# Altium project bq78pl116 BMS.PrjPcb (part 1 of 2)
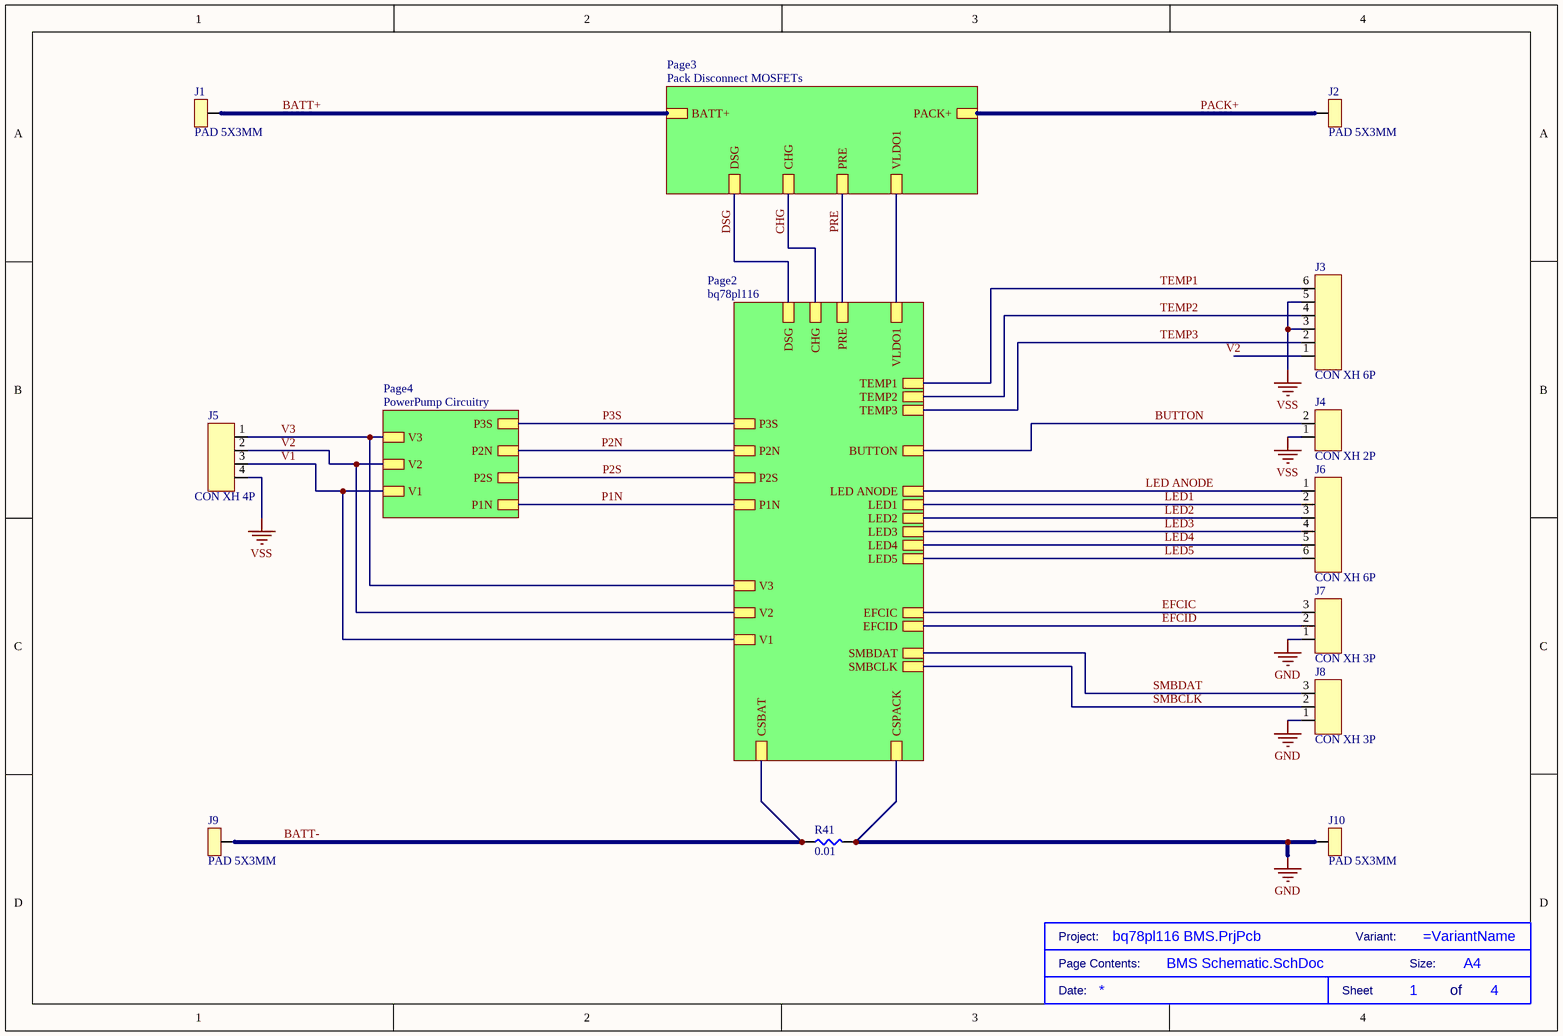
[diagram p0: BMS Schematic.SchDoc]
4 sheets, 108 parts. Net scope: hierarchical (ports join the sheet entries above them; power ports are global).
Board file: BMS PCB.PcbDoc
Sheets:
  BMS Schematic.SchDoc
    Page3 = Pack Disconnect MOSFETs.SchDoc
    Page4 = PowerPump Circuitry.SchDoc
    Page2 = bq78pl116.SchDoc

## Sheet BMS Schematic.SchDoc
size A4; DocumentNumber: 1; SheetNumber: 1; SheetTotal: 4

### Parts
(Parts that share a designator on the sheet are numbered #1, #2 ... from top to bottom, then left to right.)
*#1  Size: A4  (hidden comment: TITLE BLOCK)  (graphical)
J1  PAD 5X3MM  [PAD 5X3MM]
J2  PAD 5X3MM  [PAD 5X3MM]
J3  CON XH 6P  [XH 2.5 6P]
J4  CON XH 2P  [XH 2.5 2P]
J5  CON XH 4P  [XH 2.5 4P]
J6  CON XH 6P  [XH 2.5 6P]
J7  CON XH 3P  [XH 2.5 3P]
J8  CON XH 3P  [XH 2.5 3P]
J9  PAD 5X3MM  [PAD 5X3MM]
J10  PAD 5X3MM  [PAD 5X3MM]
R41  0.01  [RSHUNT]

### Sub-sheets
Page2 = bq78pl116: DSG, PRE, TEMP3, CHG, LED5, VLDO1, TEMP2, V2, LED3, BUTTON, LED4, LED1, LED2, SMBCLK, P1N, CSBAT, P2S, P2N, P3S, V1, V3, EFCID, EFCIC, LED ANODE, CSPACK, SMBDAT, TEMP1
Page3 = Pack Disconnect MOSFETs: VLDO1, DSG, CHG, BATT+, PRE, PACK+
Page4 = PowerPump Circuitry: P2N, P3S, P2S, P1N, V2, V3, V1

### Nets
GND: J7.1 J8.1 J10.1 R41.2 ; sheet Page2/CSPACK
VLDO1: sheet Page3/VLDO1, sheet Page2/VLDO1
VSS: J3.3 J3.5 J4.1 J5.4
BATT+: J1.1 ; sheet Page3/BATT+
BATT-: J9.1 R41.1 ; sheet Page2/CSBAT
BUTTON: J4.2 ; sheet Page2/BUTTON
CHG: sheet Page3/CHG, sheet Page2/CHG
DSG: sheet Page3/DSG, sheet Page2/DSG
EFCIC: J7.3 ; sheet Page2/EFCIC
EFCID: J7.2 ; sheet Page2/EFCID
LED1: J6.2 ; sheet Page2/LED1
LED2: J6.3 ; sheet Page2/LED2
LED3: J6.4 ; sheet Page2/LED3
LED4: J6.5 ; sheet Page2/LED4
LED5: J6.6 ; sheet Page2/LED5
LED ANODE: J6.1 ; sheet Page2/LED ANODE
P1N: sheet Page4/P1N, sheet Page2/P1N
P2N: sheet Page4/P2N, sheet Page2/P2N
P2S: sheet Page4/P2S, sheet Page2/P2S
P3S: sheet Page4/P3S, sheet Page2/P3S
PACK+: J2.1 ; sheet Page3/PACK+
PRE: sheet Page3/PRE, sheet Page2/PRE
SMBCLK: J8.2 ; sheet Page2/SMBCLK
SMBDAT: J8.3 ; sheet Page2/SMBDAT
TEMP1: J3.6 ; sheet Page2/TEMP1
TEMP2: J3.4 ; sheet Page2/TEMP2
TEMP3: J3.2 ; sheet Page2/TEMP3
V1: J5.3 ; sheet Page4/V1, sheet Page2/V1
V2: J3.1 J5.2 ; sheet Page4/V2, sheet Page2/V2
V3: J5.1 ; sheet Page4/V3, sheet Page2/V3

### Notes on the sheet
- (in symbol TITLE BLOCK) Project:; Variant:; Page Contents:; Size:; Date:; Sheet; of

### Library data of the parts
J3 J6 = CONN XH 2.5 6P: CONN HEADER VERT 6POS 2.5MM; Manufacturer: JST; Manufacturer Part Number: B6BXHA(LF)(SN); Supplier 1: Distrelec; RoHS: Yes; Category: FFC / FPC; ComponentLink1URL: https://datasheet.ciiva.com/26894/getdatasheetpartid-424647-26894806.pdf?src-supplier=Verical; ComponentLink1Description: https://datasheet.ciiva.com/26894/getdatasheetpartid-424647-26894806.pdf?src-supplier=Verical; ComponentLink2URL: https://datasheet.ciiva.com/26894/getdatasheetpartid-641012-26894489.pdf?src-supplier=Verical; ComponentLink2Description: https://datasheet.ciiva.com/26894/getdatasheetpartid-641012-26894489.pdf?src-supplier=Verical; ComponentLink3URL: https://datasheet.ciiva.com/712/exh-712511.pdf?src-supplier=Digi-Key; ComponentLink3Description: https://datasheet.ciiva.com/712/exh-712511.pdf?src-supplier=Digi-Key; ComponentLink4URL: https://datasheet.ciiva.com/16397/b6b-xh-alfsn-16397116.pdf?src-supplier=Future+Electronics; ComponentLink4Description: https://datasheet.ciiva.com/16397/b6b-xh-alfsn-16397116.pdf?src-supplier=Future+Electronics; Supplier Part Number 1: 14301998
J4 = CONN XH 2.5 2P: 2 Position Dual Row 2.5 mm Pitch Through Hole Shrouded Header; Manufacturer: JST; Manufacturer Part Number: B2B-XH-A-GU; Supplier 1: Digi-Key; RoHS: Yes; Category: Headers and Wire Housings; Stock 1: 22513; Pricing 1: 1=0,24000, 10=0,20400, 100=0,15680, 500=0,13270, 1000=0,10858, 5000=0,09652, 10000=0,08747 (USD); ComponentLink1URL: https://datasheet.ciiva.com/16417/exh-16417678.pdf?src-supplier=Future+Electronics; ComponentLink1Description: https://datasheet.ciiva.com/16417/exh-16417678.pdf?src-supplier=Future+Electronics; Supplier Part Number 1: 455-2946-ND
J5 = CONN XH 2.5 4P: XH Series 4 Position 2.5 mm Pitch Through Hole Crimp Top Entry Shrouded Header; Manufacturer: JST; Manufacturer Part Number: B4B-XH-A(LF)(SN); Supplier 1: RSComponents; RoHS: Yes; Category: FFC / FPC; Stock 1: 10520; Pricing 1: 5=0,42800, 125=0,15600, 500=0,14600, 1250=0,13600, 2500=0,12800 (GBP); ComponentLink1URL: https://datasheet.ciiva.com/16203/b4b-xh-alfsn-16203642.pdf?src-supplier=Future+Electronics; ComponentLink1Description: https://datasheet.ciiva.com/16203/b4b-xh-alfsn-16203642.pdf?src-supplier=Future+Electronics; ComponentLink2URL: https://datasheet.ciiva.com/26924/getdatasheetpartid-640571-26924035.pdf?src-supplier=Verical; ComponentLink2Description: https://datasheet.ciiva.com/26924/getdatasheetpartid-640571-26924035.pdf?src-supplier=Verical; ComponentLink3URL: https://datasheet.ciiva.com/26894/getdatasheetpartid-455616-26894787.pdf?src-supplier=Verical; ComponentLink3Description: https://datasheet.ciiva.com/26894/getdatasheetpartid-455616-26894787.pdf?src-supplier=Verical; ComponentLink4URL: https://datasheet.ciiva.com/726/exh-726404.pdf?src-supplier=Digi-Key; ComponentLink4Description: https://datasheet.ciiva.com/726/exh-726404.pdf?src-supplier=Digi-Key; Supplier Part Number 1: 8201551
J7 J8 = CONN XH 2.5 3P: Connector Header, XH Series, 3 Position, 2.50mm, Through Hole, Press-Fit, Solder, Natural; Manufacturer: JST; Manufacturer Part Number: B3B-XH-A(LF)(SN); Supplier 1: RSComponents; RoHS: Yes; Category: Headers and Wire Housings; Stock 1: 43000; Pricing 1: 1000=0,07100 (GBP); ComponentLink1URL: https://datasheet.ciiva.com/26894/getdatasheetpartid-640434-26894454.pdf?src-supplier=Verical; ComponentLink1Description: https://datasheet.ciiva.com/26894/getdatasheetpartid-640434-26894454.pdf?src-supplier=Verical; ComponentLink2URL: https://datasheet.ciiva.com/26894/getdatasheetpartid-440399-26894778.pdf?src-supplier=Verical; ComponentLink2Description: https://datasheet.ciiva.com/26894/getdatasheetpartid-440399-26894778.pdf?src-supplier=Verical; ComponentLink3URL: https://datasheet.ciiva.com/11746/0900766b8082653f-11746520.pdf?src-supplier=RSComponents; ComponentLink3Description: https://datasheet.ciiva.com/11746/0900766b8082653f-11746520.pdf?src-supplier=RSComponents; Supplier Part Number 1: 1724888
R41 = SHUNT 10m

## Sheet Pack Disconnect MOSFETs.SchDoc
size A4; DocumentNumber: 3; SheetNumber: 3; SheetTotal: 4
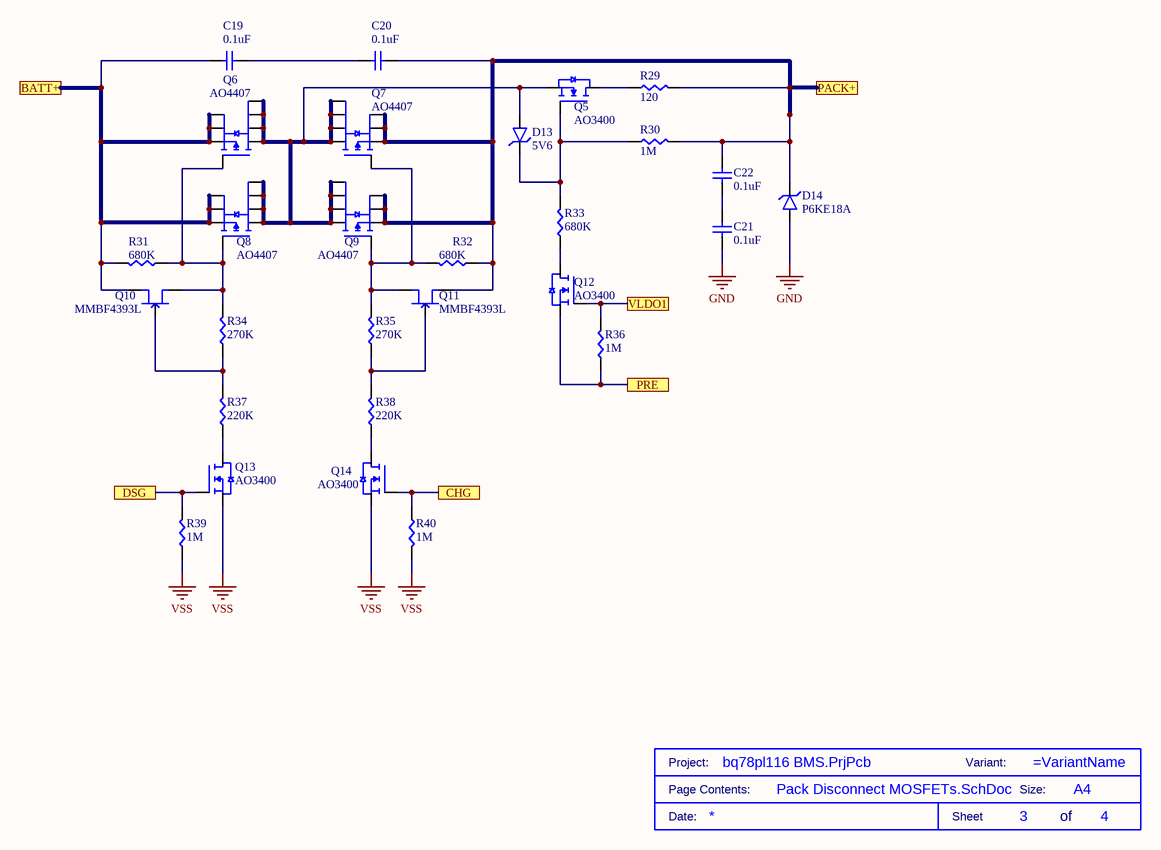
[diagram p1: Pack Disconnect MOSFETs.SchDoc]

### Parts
(Parts that share a designator on the sheet are numbered #1, #2 ... from top to bottom, then left to right.)
*#2  Size: A4  (hidden comment: TITLE BLOCK)  (graphical)
C19  0.1uF  [C0805]
C20  0.1uF  [C0805]
C21  0.1uF  [C0805]
C22  0.1uF  [C0805]
D13  5V6  [MiniMELF]
D14  P6KE18A  [DO-15]
Q5  AO3400  [SOT-23]
Q6  AO4407  [SOIC-8]
Q7  AO4407  [SOIC-8]
Q8  AO4407  [SOIC-8]
Q9  AO4407  [SOIC-8]
Q10  MMBF4393L  [SOT-23]
Q11  MMBF4393L  [SOT-23]
Q12  AO3400  [SOT-23]
Q13  AO3400  [SOT-23]
Q14  AO3400  [SOT-23]
R29  120  [RES TH 1W]
R30  1M  [R0805]
R31  680K  [R0805]
R32  680K  [R0805]
R33  680K  [R0805]
R34  270K  [R0805]
R35  270K  [R0805]
R36  1M  [R0805]
R37  220K  [R0805]
R38  220K  [R0805]
R39  1M  [R0805]
R40  1M  [R0805]

### Ports
BATT+, CHG, DSG, PACK+, PRE, VLDO1

### Nets
GND: C21.2 D14.1(A)
VLDO1: Q12.1(G) R36.2 ; port VLDO1
VSS: Q13.2(S) Q14.2(S) R39.1 R40.1
BATT+: C19.1 Q6.1(S) Q6.2(S) Q6.3(S) Q8.1(S) Q8.2(S) Q8.3(S) Q10.1(D) R31.2 ; port BATT+
CHG: Q14.1(G) R40.2 ; port CHG
DSG: Q13.1(G) R39.2 ; port DSG
PACK+: C20.2 C22.1 D14.2(K) Q7.1(S) Q7.2(S) Q7.3(S) Q9.1(S) Q9.2(S) Q9.3(S) Q11.1(D) R29.2 R30.2 R32.1 ; port PACK+
PRE: Q12.2(S) R36.1 ; port PRE
NetC19_2: C19.2 C20.1
NetC21_1: C21.1 C22.2
NetD13_1: D13.1(A) Q5.2(S) Q6.5(D) Q6.6(D) Q6.7(D) Q6.8(D) Q7.5(D) Q7.6(D) Q7.7(D) Q7.8(D) Q8.5(D) Q8.6(D) Q8.7(D) Q8.8(D) Q9.5(D) Q9.6(D) Q9.7(D) Q9.8(D)
NetD13_2: D13.2(K) Q5.1(G) R30.1 R33.2
NetQ5_3: Q5.3(D) R29.1
NetQ6_4: Q6.4(G) Q8.4(G) Q10.2(S) R31.1 R34.2
NetQ7_4: Q7.4(G) Q9.4(G) Q11.2(S) R32.2 R35.2
NetQ10_3: Q10.3(G) R34.1 R37.2
NetQ11_3: Q11.3(G) R35.1 R38.2
NetQ12_3: Q12.3(D) R33.1
NetQ13_3: Q13.3(D) R37.1
NetQ14_3: Q14.3(D) R38.1

### Notes on the sheet
- (in symbol TITLE BLOCK) Project:; Variant:; Page Contents:; Size:; Date:; Sheet; of

### Library data of the parts
C19-C22 = CAP 0805 0.1uF: Cap Ceramic 0.1uF 50V X7R 10% SMD 0805 125°C Paper T/R; Manufacturer: KEMET; Manufacturer Part Number: C0805C104K5RAC7411; Capacitance: 100nF; Supplier 1: Mouser; RoHS: Yes; Category: Ceramic Capacitors; Stock 1: 1204859; Pricing 1: 1=0,13000, 10=0,09300, 50=0,09300, 100=0,04400, 1000=0,02600, 10000=0,02100 (USD); Mount: Surface Mount; Case/Package: 0805; Dielectric Material: Ceramic; Min Operating Temperature: -55°C; Max Operating Temperature: 125°C; Packaging: Tape and Reel; Tolerance: 10%; Dielectric: X7R; Voltage Rating (DC): 50V; Construction: Flat; Length: 2mm; Height: 0.9mm; Depth: 1.25mm; Radiation Hardening: No; RoHS Compliant: Yes; ComponentLink1URL: http://components.arrow.com/part/dataview/30748302S8994022N7429?src-supplier=Arrow+Electronics; ComponentLink1Description: http://components.arrow.com/part/dataview/30748302S8994022N7429?src-supplier=Arrow+Electronics; ComponentLink2URL: https://www.verical.com/server-webapp/html/getDatasheet?partID=248513&src-supplier=Verical; ComponentLink2Description: https://www.verical.com/server-webapp/html/getDatasheet?partID=248513&src-supplier=Verical; Supplier Part Number 1: 80-C0805C104K5RACLR
D13 = ZENER 5V6: Diode Zener Single 5.6V 7% 500mW Automotive 2-Pin Mini-MELF T/R; Manufacturer: Diotec; Manufacturer Part Number: ZMM5.6; Tolerance: 5%; Supplier 1: Arrow Electronics; RoHS: Yes; Category: Zener Diodes; Stock 1: 11; Pricing 1: 1=0,10930, 10=0,02530 (USD); Case/Package: SOD; Zener Voltage: 5.6V; Power Dissipation: 500mW; RoHS Compliant: Yes; ComponentLink1URL: https://datasheet.ciiva.com/26309/rvzmm1-zmm75-data-e-26309545.pdf?src-supplier=Distrelec; ComponentLink1Description: https://datasheet.ciiva.com/26309/rvzmm1-zmm75-data-e-26309545.pdf?src-supplier=Distrelec; Supplier Part Number 1: ZMM5.6
D14 = P6KE18A: TVS DIODE 15.3VWM 32.5VC DO15; Manufacturer: Littelfuse; Clamping Voltage: 25.2V; Peak Pulse Power: 600W; Number of Unidirectional Channels: 1; Reverse Standoff Voltage: 15.3V; Min Breakdown Voltage: 17.1V; Power Line Protection: No; Peak Pulse Current: 24.2A; Max Surge Current: 24A; Polarity: Unidirectional; Test Current: 1mA; Leakage Current: 1uA; Voltage Rating (DC): 18V; Diode Type: ZENER; Max Breakdown Voltage: 18.9V; Max Power Dissipation: 5W; Supplier 1: Arrow Electronics; Manufacturer Part Number: P6KE18A; RoHS: Yes; Category: Diodes; Stock 1: 2982; Pricing 1: 1=0,51800, 10=0,42000, 25=0,41460, 100=0,29520, 250=0,29500, 500=0,23600, 1000=0,17410 (USD); Mount: Through Hole; Case/Package: DO-15; Number of Pins: 2; Min Operating Temperature: -55°C; Max Operating Temperature: 175°C; Packaging: Tape and Reel; Resistor Type: Zener; Package Quantity: 4000; Operating Supply Voltage: 15.3V; Reverse Breakdown Voltage: 17.1V; Breakdown Voltage: 17.1V; Number of Channels: 1; Termination: Axial; Number of Elements: 1; Series: P6KE; Direction: Unidirectional; Max Reverse Leakage Current: 1uA; Power Dissipation: 600W; Clamping Voltage-Max: 25.2V; Diameter: 3.6mm; Length: 7.6mm; Lead Free: Lead Free; RoHS Compliant: Yes; REACH SVHC: No SVHC; ComponentLink1URL: https://datasheet.ciiva.com/16473/littelfuse-tvs-diode-p6ke-16473576.pdf?src-supplier=Future+Electronics; ComponentLink1Description: https://datasheet.ciiva.com/16473/littelfuse-tvs-diode-p6ke-16473576.pdf?src-supplier=Future+Electronics; ComponentLink2URL: https://datasheet.ciiva.com/331/littelfuse-tvs-diode-p6ke-datasheet-pdf-331022.pdf?src-supplier=Digi-Key; ComponentLink2Description: https://datasheet.ciiva.com/331/littelfuse-tvs-diode-p6ke-datasheet-pdf-331022.pdf?src-supplier=Digi-Key; ComponentLink3URL: https://datasheet.ciiva.com/331/littelfuse-tvs-diode-p6ke-datasheet-pdf-331021.pdf?src-supplier=Digi-Key; ComponentLink3Description: https://datasheet.ciiva.com/331/littelfuse-tvs-diode-p6ke-datasheet-pdf-331021.pdf?src-supplier=Digi-Key; Supplier Part Number 1: P6KE18A
Q5 Q12-Q14 = AO3400: Trans MOSFET N-CH 30V 5.7A 3-Pin SOT-23; Manufacturer: Alpha & Omega Semiconductor; Manufacturer Part Number: AO3400A; Rds On Max: 26.5mR; Input Capacitance: 630pF; Max Power Dissipation: 1.4W; Number of Elements: 1; Gate to Source Voltage (Vgs): 12V; Supplier 1: TME; RoHS: Yes; Category: MOSFETs; Pricing 1: 10=0,07570, 50=0,06820, 250=0,06030, 1000=0,05410, 3000=0,05050 (EUR); Mount: Surface Mount; Case/Package: TO-236-3; Number of Pins: 3; Min Operating Temperature: -55°C; Max Operating Temperature: 150°C; Packaging: Tape and Reel; Series: -; Drain to Source Voltage (Vdss): 30V; Continuous Drain Current (ID): 5.7A; Power Dissipation: 1.4W; Radiation Hardening: No; RoHS Compliant: Yes; Lead Free: Lead Free; ComponentLink1URL: https://datasheet.ciiva.com/940/ao3400a-940739.pdf?src-supplier=Digi-Key; ComponentLink1Description: https://datasheet.ciiva.com/940/ao3400a-940739.pdf?src-supplier=Digi-Key; ComponentLink2URL: https://datasheet.ciiva.com/26906/getdatasheetpartid-64438-26906526.pdf?src-supplier=Verical; ComponentLink2Description: https://datasheet.ciiva.com/26906/getdatasheetpartid-64438-26906526.pdf?src-supplier=Verical; ComponentLink3URL: https://datasheet.ciiva.com/940/ao3400a-940740.pdf?src-supplier=Digi-Key; ComponentLink3Description: https://datasheet.ciiva.com/940/ao3400a-940740.pdf?src-supplier=Digi-Key; ComponentLink4URL: https://datasheet.ciiva.com/940/ao3400a-940741.pdf?src-supplier=Digi-Key; ComponentLink4Description: https://datasheet.ciiva.com/940/ao3400a-940741.pdf?src-supplier=Digi-Key; Supplier Part Number 1: AO3400A
Q6-Q9 = AO4407: MOSFET P-CH 30V 12A 8SOIC; Manufacturer: Alpha & Omega Semiconductor; Manufacturer Part Number: AO4407A; Rds On Max: 11mR; Input Capacitance: 2.6nF; Max Power Dissipation: 3.1W; Number of Elements: 1; Gate to Source Voltage (Vgs): 25V; ComponentLink1URL: https://media.digikey.com/pdf/Data%20Sheets/Alpha%20&amp;%20Omega/AO4407_Doc..pdf?src-supplier=Digi-Key; ComponentLink1Description: https://media.digikey.com/pdf/Data%20Sheets/Alpha%20&amp;%20Omega/AO4407_Doc..pdf?src-supplier=Digi-Key; Supplier 1: Arrow Electronics; RoHS: Yes; Category: MOSFETs; Stock 1: 3000; Pricing 1: 3000=0,93470, 6000=0,85170, 9000=0,75520, 15000=0,71280, 24000=0,62350, 30000=0,61730 (USD); Mount: Surface Mount; Case/Package: SOIC; Number of Pins: 8; Min Operating Temperature: -55°C; Max Operating Temperature: 150°C; Packaging: Tape and Reel; Drain to Source Voltage (Vdss): 30V; Continuous Drain Current (ID): 12A; Power Dissipation: 3.1W; Series: -; Radiation Hardening: No; Lead Free: Lead Free; RoHS Compliant: Yes; ComponentLink2URL: https://datasheet.ciiva.com/940/ao4407a-940836.pdf?src-supplier=Digi-Key; ComponentLink2Description: https://datasheet.ciiva.com/940/ao4407a-940836.pdf?src-supplier=Digi-Key; ComponentLink3URL: https://datasheet.ciiva.com/940/ao4407a-940838.pdf?src-supplier=Digi-Key; ComponentLink3Description: https://datasheet.ciiva.com/940/ao4407a-940838.pdf?src-supplier=Digi-Key; Supplier Part Number 1: AO4407A
Q10 Q11 = MMBF4393L: Trans Jfet N-ch 30V 3-PIN SOT-23 T/r; Manufacturer: ON Semiconductor; Manufacturer Part Number: MMBF4393LT3G; Input Capacitance: 14pF; Max Power Dissipation: 225mW; Element Configuration: Single; Polarity: N-CHANNEL; Supplier 1: Digi-Key; RoHS: Yes; Category: JFETs; Stock 1: 422; Pricing 1: 1=0,41000, 10=0,33600, 100=0,22840, 500=0,17134, 1000=0,12850, 2000=0,11780, 5000=0,11065 (USD); Mount: Surface Mount; Case/Package: SOT-23; Number of Pins: 3; Weight: 0.00709oz; Min Operating Temperature: -55°C; Max Operating Temperature: 150°C; Packaging: Tape and Reel; Package Quantity: 10000; Drain to Source Voltage (Vdss): 30V; Gate to Source Voltage (Vgs): 30V; Power Dissipation: 225mW; Breakdown Voltage: 30V; Series: -; Reach SVHC Compliant: Yes; Lead Free: Lead Free; Halogen Free: Halogen Free; RoHS Compliant: Yes; ComponentLink1URL: https://datasheet.ciiva.com/961/mmbf4391lt1-d-961042.pdf?src-supplier=Avnet; ComponentLink1Description: https://datasheet.ciiva.com/961/mmbf4391lt1-d-961042.pdf?src-supplier=Avnet; ComponentLink2URL: https://datasheet.ciiva.com/961/mmbf4391lt1-d-961129.pdf?src-supplier=Digi-Key; ComponentLink2Description: https://datasheet.ciiva.com/961/mmbf4391lt1-d-961129.pdf?src-supplier=Digi-Key; Supplier Part Number 1: MMBF4393LT3GOSCT-ND
R29 = RES TH 120 1W: Ultra Miniature Style Metal Film Resistor 120Ohm 1W 5% Axial T/R; Manufacturer: Yageo; Manufacturer Part Number: FMP100JR-52-120R; Resistance: 120R; Supplier 1: Arrow Electronics; RoHS: Yes; Category: Through-Hole Resistors; Stock 1: 18475; Pricing 1: 1=0,18070, 10=0,15020, 25=0,10430, 100=0,06410, 250=0,04920, 500=0,03870, 1000=0,02670, 3000=0,02540, 6000=0,02180, 15000=0,02010 (USD); Case/Package: Axial; Min Operating Temperature: -55°C; Max Operating Temperature: 155°C; Package Quantity: 1; Tolerance: 5%; Packaging: Tape and Reel; Number of Terminations: 2; Max Power Dissipation: 1W; Series: FMP; Resistor Type: Metal Film; Length: 0.248inch; Lead Free: Lead Free; RoHS Compliant: Yes; ComponentLink1URL: https://datasheet.ciiva.com/2710/yageolr-fmp-2013-2710614.pdf?src-supplier=Digi-Key; ComponentLink1Description: https://datasheet.ciiva.com/2710/yageolr-fmp-2013-2710614.pdf?src-supplier=Digi-Key; ComponentLink2URL: https://datasheet.ciiva.com/2710/yageolr-fmp-2013-2710613.pdf?src-supplier=Digi-Key; ComponentLink2Description: https://datasheet.ciiva.com/2710/yageolr-fmp-2013-2710613.pdf?src-supplier=Digi-Key; Supplier Part Number 1: FMP100JR-52-120R
R30 R36 R39 R40 = RES 0805 1M: Res Thick Film 0805 1M Ohm 5% 0.125W(1/8W) ±200ppm/°C Pad SMD T/R; Manufacturer: Vishay; Manufacturer Part Number: CRCW08051M00JNEAC; Supplier 1: Mouser; RoHS: No; Category: Chip SMD Resistors; Stock 1: 183; Pricing 1: 1=0,10000, 10=0,04000, 50=0,04000, 100=0,01700, 250=0,01600, 500=0,01500, 1000=0,00800, 2500=0,00700, 5000=0,00500, 10000=0,00500 (USD); Supplier Part Number 1: 71-CRCW08051M00JNEAC
R31-R33 = RES 0805 680K: Res Thick Film 0805 680K Ohm 5% 1/8W ±200ppm/°C Molded SMD SMD Paper T/R; Manufacturer: Vishay Dale; Manufacturer Part Number: CRCW0805680KJNEA; Resistance: 680kR; Power Rating: 125mW; Voltage Rating: 150V; Supplier 1: Digi-Key; RoHS: Yes; Category: Chip SMD Resistors; Stock 1: 65; Pricing 1: 1=0,10000, 10=0,04800, 100=0,01950, 1000=0,00874, 2500=0,00759 (USD); Case/Package: 0805; Number of Pins: 2; Weight: 0.000194oz; Case Code (Metric): 2012; Case Code (Imperial): 0805; Contact Plating: Tin; Size Code: 0805; Min Operating Temperature: -55°C; Max Operating Temperature: 155°C; Package Quantity: 1; Tolerance: 5%; Packaging: Tape and Reel; Resistor Type: Thick Film; Number of Terminations: 2; Temperature Coefficient: 200ppm/°C; Max Power Dissipation: 125mW; Voltage Rating (DC): 150V; Features: Automotive AEC-Q200; Series: CRCW; Resistance Tolerance: 5%; Construction: Rectangular; Length: 2mm; Width: 0.049inch; Height: 0.02inch; Depth: 1.25mm; Radiation Hardening: No; REACH SVHC: Unknown; Military Standard: Not; Lead Free: Lead Free; RoHS Compliant: Yes; ComponentLink1URL: https://datasheet.ciiva.com/2493/dcrcwe3-2493920.pdf?src-supplier=Digi-Key; ComponentLink1Description: https://datasheet.ciiva.com/2493/dcrcwe3-2493920.pdf?src-supplier=Digi-Key; ComponentLink2URL: https://datasheet.ciiva.com/2493/dcrcwe3-2493921.pdf?src-supplier=Digi-Key; ComponentLink2Description: https://datasheet.ciiva.com/2493/dcrcwe3-2493921.pdf?src-supplier=Digi-Key; ComponentLink3URL: https://datasheet.ciiva.com/5546/dcrcwe3-109170-5546277.pdf?src-supplier=Mouser; ComponentLink3Description: https://datasheet.ciiva.com/5546/dcrcwe3-109170-5546277.pdf?src-supplier=Mouser; ComponentLink4URL: https://datasheet.ciiva.com/8924/dcrcwe3-8924022.pdf?src-supplier=Avnet; ComponentLink4Description: https://datasheet.ciiva.com/8924/dcrcwe3-8924022.pdf?src-supplier=Avnet; ComponentLink5URL: https://datasheet.ciiva.com/2493/dcrcwe3-2493919.pdf?src-supplier=Digi-Key; ComponentLink5Description: https://datasheet.ciiva.com/2493/dcrcwe3-2493919.pdf?src-supplier=Digi-Key; Supplier Part Number 1: 541-680KACT-ND
R34 R35 = RES 0805 270K: Res Thick Film 0805 270K Ohm 5% 1/8W ±200ppm/°C Molded SMD SMD Paper T/R; Manufacturer: Vishay Dale; Manufacturer Part Number: CRCW0805270KJNEA; Resistance: 270kR; Power Rating: 125mW; Voltage Rating: 150V; Supplier 1: Arrow Electronics; RoHS: Yes; Category: Chip SMD Resistors; Stock 1: 4; Pricing 1: 1=0,04400 (USD); Case/Package: 0805; Number of Pins: 2; Weight: 0.000194oz; Case Code (Metric): 2012; Case Code (Imperial): 0805; Contact Plating: Tin; Size Code: 0805; Min Operating Temperature: -55°C; Max Operating Temperature: 155°C; Tolerance: 5%; Packaging: Tape and Reel; Package Quantity: 1; Resistor Type: Thick Film; Number of Terminations: 2; Termination: SMD/SMT; Temperature Coefficient: 200ppm/°C; Max Power Dissipation: 125mW; Voltage Rating (DC): 150V; Features: Automotive AEC-Q200; Series: CRCW; Construction: Rectangular; Resistance Tolerance: 5%; Length: 2mm; Width: 0.049inch; Height: 0.02inch; Depth: 1.25mm; Radiation Hardening: No; REACH SVHC: Unknown; Military Standard: Not; Lead Free: Lead Free; RoHS Compliant: Yes; ComponentLink1URL: https://datasheet.ciiva.com/2493/dcrcwe3-2493829.pdf?src-supplier=Digi-Key; ComponentLink1Description: https://datasheet.ciiva.com/2493/dcrcwe3-2493829.pdf?src-supplier=Digi-Key; ComponentLink2URL: https://datasheet.ciiva.com/2493/dcrcwe3-2493830.pdf?src-supplier=Digi-Key; ComponentLink2Description: https://datasheet.ciiva.com/2493/dcrcwe3-2493830.pdf?src-supplier=Digi-Key; ComponentLink3URL: https://datasheet.ciiva.com/2493/dcrcwe3-2493831.pdf?src-supplier=Digi-Key; ComponentLink3Description: https://datasheet.ciiva.com/2493/dcrcwe3-2493831.pdf?src-supplier=Digi-Key; ComponentLink4URL: https://datasheet.ciiva.com/3258/dcrcwe3-3258391.pdf?src-supplier=Avnet; ComponentLink4Description: https://datasheet.ciiva.com/3258/dcrcwe3-3258391.pdf?src-supplier=Avnet; ComponentLink5URL: https://datasheet.ciiva.com/5549/dcrcwe3-109170-5549770.pdf?src-supplier=Mouser; ComponentLink5Description: https://datasheet.ciiva.com/5549/dcrcwe3-109170-5549770.pdf?src-supplier=Mouser; ComponentLink6URL: https://datasheet.ciiva.com/16500/dcrcwe3-16500506.pdf?src-supplier=Future+Electronics; ComponentLink6Description: https://datasheet.ciiva.com/16500/dcrcwe3-16500506.pdf?src-supplier=Future+Electronics; Supplier Part Number 1: CRCW0805270KJNEA
R37 R38 = RES 0805 220K: Res Thick Film 0805 220K Ohm 5% 1/8W ±200ppm/°C Molded SMD SMD Paper T/R; Manufacturer: Vishay Dale; Manufacturer Part Number: CRCW0805220KJNEA; Resistance: 220kR; Power Rating: 125mW; Voltage Rating: 150V; Supplier 1: Arrow Electronics; RoHS: Yes; Category: Chip SMD Resistors; Stock 1: 277; Pricing 1: 1=0,05510, 10=0,03660, 25=0,03490, 50=0,03450, 100=0,02070, 250=0,01310 (USD); Mount: Surface Mount; Case/Package: 0805; Weight: 0.000194oz; Case Code (Metric): 2012; Case Code (Imperial): 0805; Contact Plating: Tin; Size Code: 0805; Min Operating Temperature: -55°C; Max Operating Temperature: 155°C; Package Quantity: 1; Tolerance: 5%; Packaging: Tape and Reel; Resistor Type: Thick Film; Number of Terminations: 2; Termination: SMD/SMT; Temperature Coefficient: 200ppm/°C; Max Power Dissipation: 125mW; Voltage Rating (DC): 150V; Features: Automotive AEC-Q200; Series: CRCW; Construction: Rectangular; Resistance Tolerance: 5%; Length: 2mm; Width: 0.049inch; Height: 0.02inch; Depth: 1.25mm; Radiation Hardening: No; REACH SVHC: Unknown; Military Standard: Not; Lead Free: Lead Free; RoHS Compliant: Yes; ComponentLink1URL: https://datasheet.ciiva.com/2464/dcrcwe3-2464864.pdf?src-supplier=Digi-Key; ComponentLink1Description: https://datasheet.ciiva.com/2464/dcrcwe3-2464864.pdf?src-supplier=Digi-Key; ComponentLink2URL: https://datasheet.ciiva.com/2464/dcrcwe3-2464865.pdf?src-supplier=Digi-Key; ComponentLink2Description: https://datasheet.ciiva.com/2464/dcrcwe3-2464865.pdf?src-supplier=Digi-Key; ComponentLink3URL: https://datasheet.ciiva.com/2464/dcrcwe3-2464866.pdf?src-supplier=Digi-Key; ComponentLink3Description: https://datasheet.ciiva.com/2464/dcrcwe3-2464866.pdf?src-supplier=Digi-Key; ComponentLink4URL: https://datasheet.ciiva.com/3258/dcrcwe3-3258325.pdf?src-supplier=Avnet; ComponentLink4Description: https://datasheet.ciiva.com/3258/dcrcwe3-3258325.pdf?src-supplier=Avnet; ComponentLink5URL: https://datasheet.ciiva.com/28606/1747939-28606759.pdf?src-supplier=Element14; ComponentLink5Description: https://datasheet.ciiva.com/28606/1747939-28606759.pdf?src-supplier=Element14; ComponentLink6URL: https://datasheet.ciiva.com/16498/dcrcw-16498286.pdf?src-supplier=Future+Electronics; ComponentLink6Description: https://datasheet.ciiva.com/16498/dcrcw-16498286.pdf?src-supplier=Future+Electronics; Supplier Part Number 1: CRCW0805220KJNEA

## Sheet PowerPump Circuitry.SchDoc
size A4; DocumentNumber: 4; SheetNumber: 4; SheetTotal: 4
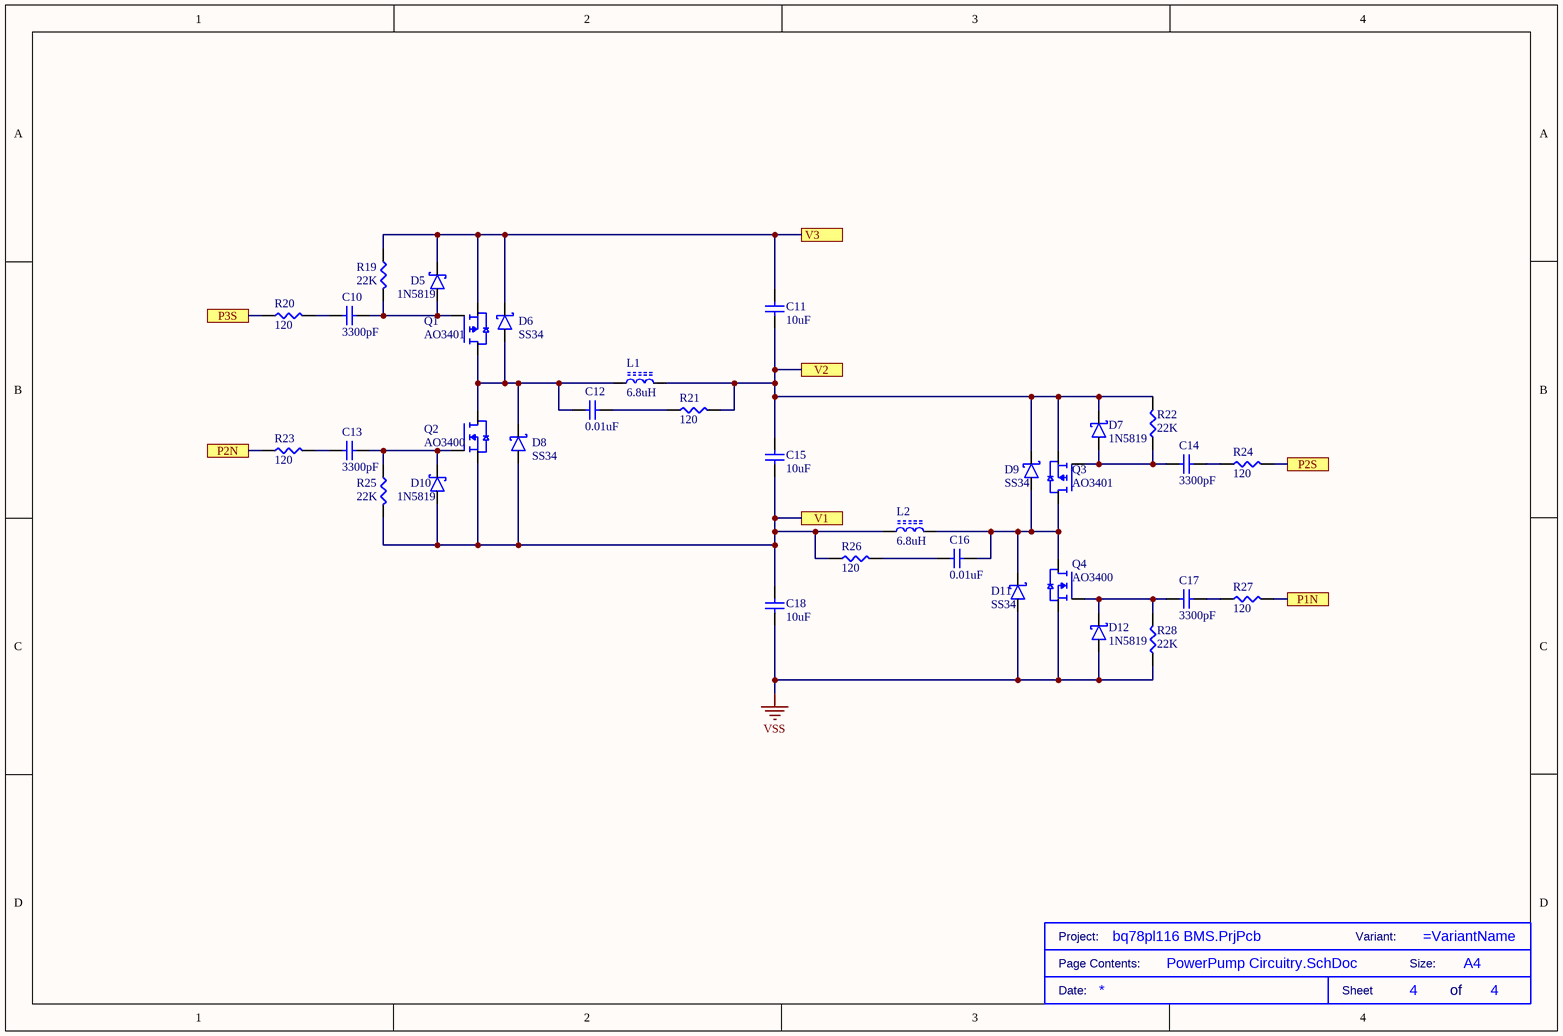
[diagram p2: PowerPump Circuitry.SchDoc]

### Parts
(Parts that share a designator on the sheet are numbered #1, #2 ... from top to bottom, then left to right.)
*#3  Size: A4  (hidden comment: TITLE BLOCK)  (graphical)
C10  3300pF  [C0805]
C11  10uF  [C0805]
C12  0.01uF  [C0805]
C13  3300pF  [C0805]
C14  3300pF  [C0805]
C15  10uF  [C0805]
C16  0.01uF  [C0805]
C17  3300pF  [C0805]
C18  10uF  [C0805]
D5  1N5819  [SOD123]
D6  SS34  [DO-214AA-SMB]
D7  1N5819  [SOD123]
D8  SS34  [DO-214AA-SMB]
D9  SS34  [DO-214AA-SMB]
D10  1N5819  [SOD123]
D11  SS34  [DO-214AA-SMB]
D12  1N5819  [SOD123]
L1  6.8uH  [CDRH5D28R]
L2  6.8uH  [CDRH5D28R]
Q1  AO3401  [SOT-23]
Q2  AO3400  [SOT-23]
Q3  AO3401  [SOT-23]
Q4  AO3400  [SOT-23]
R19  22K  [R0805]
R20  120  [R0805]
R21  120  [R0805]
R22  22K  [R0805]
R23  120  [R0805]
R24  120  [R0805]
R25  22K  [R0805]
R26  120  [R0805]
R27  120  [R0805]
R28  22K  [R0805]

### Ports
P1N, P2N, P2S, P3S, V1, V2, V3

### Nets
VSS: C18.2 D11.1(A) D12.1(A) Q4.2(S) R28.1
P1N: R27.2 ; port P1N
P2N: R23.1 ; port P2N
P2S: R24.2 ; port P2S
P3S: R20.1 ; port P3S
V1: C15.2 C18.1 D8.1(A) D10.1(A) L2.1 Q2.2(S) R25.1 R26.1 ; port V1
V2: C11.2 C15.1 D7.2(K) D9.2(K) L1.2 Q3.2(S) R21.2 R22.2 ; port V2
V3: C11.1 D5.2(K) D6.2(K) Q1.2(S) R19.2 ; port V3
NetC10_1: C10.1 R20.2
NetC10_2: C10.2 D5.1(A) Q1.1(G) R19.1
NetC12_1: C12.1 D6.1(A) D8.2(K) L1.1 Q1.3(D) Q2.3(D)
NetC12_2: C12.2 R21.1
NetC13_1: C13.1 R23.2
NetC13_2: C13.2 D10.2(K) Q2.1(G) R25.2
NetC14_1: C14.1 D7.1(A) Q3.1(G) R22.1
NetC14_2: C14.2 R24.1
NetC16_1: C16.1 R26.2
NetC16_2: C16.2 D9.1(A) D11.2(K) L2.2 Q3.3(D) Q4.3(D)
NetC17_1: C17.1 D12.2(K) Q4.1(G) R28.2
NetC17_2: C17.2 R27.1

### Notes on the sheet
- (in symbol TITLE BLOCK) Project:; Variant:; Page Contents:; Size:; Date:; Sheet; of

### Library data of the parts
C10 C13 C14 C17 = CAP 0805 3300pF: Cap Ceramic 0.0033uF 50V X7R 10% SMD 0805 125C Paper T/R; Manufacturer: KEMET; Manufacturer Part Number: C0805C332K5RACTU; Capacitance: 3.3nF; Dissipation Factor: 2.5%; Supplier 1: Arrow Electronics; RoHS: Yes; Category: Ceramic Capacitors; Stock 1: 104000; Pricing 1: 4000=0,00790, 40000=0,00630 (USD); Mount: Surface Mount; Case/Package: 0805; Number of Pins: 2; Case Code (Metric): 2012; Case Code (Imperial): 0805; Contact Plating: Tin,Matte; Dielectric Material: Ceramic; Min Operating Temperature: -55°C; Max Operating Temperature: 125°C; Packaging: Tape and Reel; Tolerance: 10%; Voltage Rating: 50V; Package Quantity: 1; Voltage Rating (DC): 50V; Dielectric: X7R; Termination: SMD/SMT; Voltage: 50V; Series: C; Construction: Flat; Length: 2mm; Width: 0.049inch; Height: 0.78mm; Thickness: 0.035inch; Lead Pitch: 0.75mm; Depth: 1.25mm; Radiation Hardening: No; REACH SVHC: No SVHC; RoHS Compliant: Yes; ComponentLink1URL: https://datasheet.ciiva.com/7842/kem-c1002-x7r-smd-7842598.pdf?src-supplier=Element14; ComponentLink1Description: https://datasheet.ciiva.com/7842/kem-c1002-x7r-smd-7842598.pdf?src-supplier=Element14; ComponentLink2URL: https://datasheet.ciiva.com/26948/getdatasheetpartid-385720-26948486.pdf?src-supplier=Verical; ComponentLink2Description: https://datasheet.ciiva.com/26948/getdatasheetpartid-385720-26948486.pdf?src-supplier=Verical; ComponentLink3URL: https://datasheet.ciiva.com/5415/kem-c1002-x7r-smd-357932-5415032.pdf?src-supplier=Mouser; ComponentLink3Description: https://datasheet.ciiva.com/5415/kem-c1002-x7r-smd-357932-5415032.pdf?src-supplier=Mouser; ComponentLink4URL: https://datasheet.ciiva.com/6126/kem-c1002-x7r-smd-6126698.pdf?src-supplier=Farnell; ComponentLink4Description: https://datasheet.ciiva.com/6126/kem-c1002-x7r-smd-6126698.pdf?src-supplier=Farnell; ComponentLink5URL: https://datasheet.ciiva.com/7842/1851736-7842314.pdf?src-supplier=Element14; ComponentLink5Description: https://datasheet.ciiva.com/7842/1851736-7842314.pdf?src-supplier=Element14; ComponentLink6URL: https://datasheet.ciiva.com/7842/1851736-7842315.pdf?src-supplier=Element14; ComponentLink6Description: https://datasheet.ciiva.com/7842/1851736-7842315.pdf?src-supplier=Element14; ComponentLink7URL: https://datasheet.ciiva.com/14589/70095383-14589486.pdf?src-supplier=Allied+Electronics; ComponentLink7Description: https://datasheet.ciiva.com/14589/70095383-14589486.pdf?src-supplier=Allied+Electronics; ComponentLink8URL: https://datasheet.ciiva.com/28688/1851736-28688671.pdf?src-supplier=Element14; ComponentLink8Description: https://datasheet.ciiva.com/28688/1851736-28688671.pdf?src-supplier=Element14; Supplier Part Number 1: C0805C332K5RACTU
C11 C15 C18 = CAP 0805 10uF: Cap Ceramic 10uF 10V X5R 10% SMD 0805 85C Plastic T/R; Manufacturer: KEMET; Manufacturer Part Number: C0805L106K8PACTU; Supplier 1: Mouser; RoHS: Yes; Category: Ceramic Capacitors; Stock 1: 15642; Pricing 1: 1=0,73000, 10=0,54000, 50=0,54000, 100=0,37000, 1000=0,24700, 10000=0,21500 (USD); Mount: Surface Mount; Case/Package: 0805; Case Code (Metric): 2012; Case Code (Imperial): 0805; Min Operating Temperature: -55°C; Max Operating Temperature: 85°C; Package Quantity: 4000; Capacitance: 10uF; Voltage Rating: 10V; Tolerance: 10%; Packaging: Tape and Reel; Dielectric: X5R; Termination: SMD/SMT; Voltage Rating (DC): 10V; Series: C; Length: 0.079inch; Width: 0.049inch; Thickness: 0.037inch; Depth: 1.25mm; REACH SVHC: No SVHC; RoHS Compliant: Yes; ComponentLink1URL: https://datasheet.ciiva.com/23928/1751297-23928886.pdf?src-supplier=Newark; ComponentLink1Description: https://datasheet.ciiva.com/23928/1751297-23928886.pdf?src-supplier=Newark; ComponentLink2URL: https://datasheet.ciiva.com/232/mlcclowprofile-232272.pdf?src-supplier=Digi-Key; ComponentLink2Description: https://datasheet.ciiva.com/232/mlcclowprofile-232272.pdf?src-supplier=Digi-Key; ComponentLink3URL: https://datasheet.ciiva.com/193/mlcclowprofile-193796.pdf?src-supplier=Digi-Key; ComponentLink3Description: https://datasheet.ciiva.com/193/mlcclowprofile-193796.pdf?src-supplier=Digi-Key; ComponentLink4URL: https://datasheet.ciiva.com/232/mlcclowprofile-232271.pdf?src-supplier=Digi-Key; ComponentLink4Description: https://datasheet.ciiva.com/232/mlcclowprofile-232271.pdf?src-supplier=Digi-Key; Supplier Part Number 1: 80-C0805L106K8P
C12 C16 = CAP 0805 0.01uF: Cap Ceramic 0.01uF 16V X7R 10% SMD 0805 125°C Paper T/R; Manufacturer: KEMET; Manufacturer Part Number: C0805C103K4RACTU; Capacitance: 10nF; Supplier 1: Arrow Electronics; RoHS: Yes; Category: Ceramic Capacitors; Stock 1: 24000; Pricing 1: 4000=0,07000, 8000=0,06640, 12000=0,06580, 20000=0,06310, 24000=0,05650, 100000=0,04830 (USD); Mount: Surface Mount; Case/Package: 0805; Case Code (Metric): 2012; Case Code (Imperial): 0805; Dielectric Material: Ceramic; Min Operating Temperature: -55°C; Max Operating Temperature: 125°C; Package Quantity: 1; Voltage Rating: 16V; Tolerance: 10%; Packaging: Tape and Reel; Voltage Rating (DC): 16V; Dielectric: X7R; Termination: SMD/SMT; Length: 2mm; Width: 0.049inch; Height: 0.78mm; Thickness: 0.035inch; Lead Pitch: 0.75mm; Depth: 1.25mm; Radiation Hardening: No; REACH SVHC: No SVHC; ComponentLink1URL: http://www.farnell.com/datasheets/2746090.pdf?src-supplier=Farnell; ComponentLink1Description: http://www.farnell.com/datasheets/2746090.pdf?src-supplier=Farnell; ComponentLink2URL: http://www.mouser.com/ds/2/212/KEM_C1002_X7R_SMD-1102033.pdf?src-supplier=Mouser; ComponentLink2Description: http://www.mouser.com/ds/2/212/KEM_C1002_X7R_SMD-1102033.pdf?src-supplier=Mouser; ComponentLink3URL: https://api.kemet.com/component-edge/download/datasheet/C0805C103K4RACTU.pdf?src-supplier=Digi-Key; ComponentLink3Description: https://api.kemet.com/component-edge/download/datasheet/C0805C103K4RACTU.pdf?src-supplier=Digi-Key; ComponentLink4URL: http://www.farnell.com/datasheets/1791936.pdf?src-supplier=Newark; ComponentLink4Description: http://www.farnell.com/datasheets/1791936.pdf?src-supplier=Newark; ComponentLink5URL: http://www.farnell.com/datasheets/2746090.pdf?src-supplier=Newark; ComponentLink5Description: http://www.farnell.com/datasheets/2746090.pdf?src-supplier=Newark; ComponentLink6URL: http://www.farnell.com/datasheets/2064983.pdf?src-supplier=Element14; ComponentLink6Description: http://www.farnell.com/datasheets/2064983.pdf?src-supplier=Element14; ComponentLink7URL: http://components.arrow.com/part/dataview/3450723S5469568N7429?src-supplier=Arrow+Electronics; ComponentLink7Description: http://components.arrow.com/part/dataview/3450723S5469568N7429?src-supplier=Arrow+Electronics; Supplier Part Number 1: C0805C103K4RACTU
D5 D7 D10 D12 = 1N5819HW-7-F: VR=40V IF=1A 60pF P=450mW; Manufacturer: Diodes; Forward Voltage: 450mV; Forward Current: 1A; Max Power Dissipation: 450mW; Max Reverse Current: 50uA; Element Configuration: Single; Max Repetitive Reverse Voltage (Vrrm): 40V; Max Forward Surge Current (Ifsm): 25A; Polarity: Standard; Capacitance: 110pF; Supplier 1: RSComponents; Manufacturer Part Number: 1N5819HW-7-F; RoHS: Yes; Category: Schottky Diodes; Stock 1: 100; Pricing 1: 25=0,32800, 150=0,18600, 750=0,12400, 1500=0,09400 (GBP); Case/Package: SOD-123-2; Number of Pins: 2; Weight: 0.000353oz; Contact Plating: Tin,Matte; Min Operating Temperature: -65°C; Max Operating Temperature: 125°C; Package Quantity: 3000; Packaging: Tape and Reel; Average Rectified Current: 1A; Peak Non-Repetitive Surge Current: 25A; Termination: SMD/SMT; Voltage Rating (DC): 40V; Current Rating: 1A; Output Current: 1A; Max Reverse Voltage (DC): 40V; Series: -; Length: 2.85mm; Width: 1.7mm; Height: 1.25mm; Radiation Hardening: No; REACH SVHC: No SVHC; Lead Free: Lead Free; RoHS Compliant: Yes; ComponentLink1URL: https://datasheet.ciiva.com/27092/1538419-27092484.pdf?src-supplier=Jameco; ComponentLink1Description: https://datasheet.ciiva.com/27092/1538419-27092484.pdf?src-supplier=Jameco; ComponentLink2URL: https://datasheet.ciiva.com/16303/ds30217-16303296.pdf?src-supplier=Future+Electronics; ComponentLink2Description: https://datasheet.ciiva.com/16303/ds30217-16303296.pdf?src-supplier=Future+Electronics; ComponentLink3URL: https://datasheet.ciiva.com/1177/ds30217-1177089.pdf?src-supplier=Element14; ComponentLink3Description: https://datasheet.ciiva.com/1177/ds30217-1177089.pdf?src-supplier=Element14; ComponentLink4URL: https://datasheet.ciiva.com/8303/ds30217-8303132.pdf?src-supplier=Avnet; ComponentLink4Description: https://datasheet.ciiva.com/8303/ds30217-8303132.pdf?src-supplier=Avnet; ComponentLink5URL: https://datasheet.ciiva.com/912/ds30217-912802.pdf?src-supplier=Digi-Key; ComponentLink5Description: https://datasheet.ciiva.com/912/ds30217-912802.pdf?src-supplier=Digi-Key; ComponentLink6URL: https://datasheet.ciiva.com/912/ds30217-912803.pdf?src-supplier=Digi-Key; ComponentLink6Description: https://datasheet.ciiva.com/912/ds30217-912803.pdf?src-supplier=Digi-Key; ComponentLink7URL: https://datasheet.ciiva.com/912/ds30217-912801.pdf?src-supplier=Digi-Key; ComponentLink7Description: https://datasheet.ciiva.com/912/ds30217-912801.pdf?src-supplier=Digi-Key; Supplier Part Number 1: 7082197
D6 D8 D9 D11 = SS34: Diode Schottky 3A 40V Smb; Manufacturer: Comchip; Manufacturer Part Number: SS34B-HF; Supplier 1: Mouser; RoHS: No; Stock 1: 18569; Pricing 1: 1=0,44000, 10=0,29300, 50=0,29300, 100=0,17900, 1000=0,11900, 3000=0,10200, 9000=0,09500, 10000=0,09500, 24000=0,08700, 45000=0,08400, 99000=0,08100 (USD); Supplier Part Number 1: 750-SS34B-HF
L1 L2 = CDRH5D28RHPNP-6R8NC: Ind Power 6.8uH 25% Ferrite Drum Core T/R; Manufacturer: Sumida; Supplier 1: Rutronik; Manufacturer Part Number: CDRH5D28RHPNP-6R8NC; RoHS: Yes; Category: Inductors; Stock 1: 20000; Pricing 1: 2000=0,41000, 4000=0,36900, 8000=0,36560, 12000=0,35530 (USD); RoHS Compliant: Yes; Supplier Part Number 1: IND14645
Q1 Q3 = AO3401: Trans Mosfet P-ch 30V 4A 3-PIN SOT-23 T/r; Manufacturer: Alpha & Omega Semiconductor; Manufacturer Part Number: AO3401A; Rds On Max: 44mR; Input Capacitance: 1.2nF; Max Power Dissipation: 1.4W; Number of Elements: 1; Supplier 1: LCSC; RoHS: Yes; Category: MOSFETs; Stock 1: 49175; Pricing 1: 5=0,13080, 50=0,10770, 150=0,09610, 500=0,08750, 2500=0,08060, 5000=0,07710 (USD); Mount: Surface Mount; Case/Package: TO-236-3; Number of Pins: 3; Min Operating Temperature: -55°C; Max Operating Temperature: 150°C; Packaging: Tape and Reel; Drain to Source Voltage (Vdss): 30V; Continuous Drain Current (ID): 4A; Power Dissipation: 1.4W; Series: -; Radiation Hardening: No; Lead Free: Lead Free; RoHS Compliant: Yes; ComponentLink1URL: https://datasheet.ciiva.com/940/ao3401a-940720.pdf?src-supplier=Digi-Key; ComponentLink1Description: https://datasheet.ciiva.com/940/ao3401a-940720.pdf?src-supplier=Digi-Key; ComponentLink2URL: https://datasheet.ciiva.com/26927/getdatasheetpartid-79048-26927888.pdf?src-supplier=Verical; ComponentLink2Description: https://datasheet.ciiva.com/26927/getdatasheetpartid-79048-26927888.pdf?src-supplier=Verical; Supplier Part Number 1: C15127
Q2 Q4 = AO3400: as Q5 on sheet Pack Disconnect MOSFETs; Supplier 1: TME; RoHS: Yes; Category: MOSFETs; Pricing 1: 10=0,07570, 50=0,06820, 250=0,06030, 1000=0,05410, 3000=0,05050 (EUR); Mount: Surface Mount; Case/Package: TO-236-3; Number of Pins: 3; Min Operating Temperature: -55°C; Max Operating Temperature: 150°C; Packaging: Tape and Reel; Series: -; Drain to Source Voltage (Vdss): 30V; Continuous Drain Current (ID): 5.7A; Power Dissipation: 1.4W; Radiation Hardening: No; RoHS Compliant: Yes; Lead Free: Lead Free; ComponentLink1URL: https://datasheet.ciiva.com/940/ao3400a-940739.pdf?src-supplier=Digi-Key; ComponentLink1Description: https://datasheet.ciiva.com/940/ao3400a-940739.pdf?src-supplier=Digi-Key; ComponentLink2URL: https://datasheet.ciiva.com/26906/getdatasheetpartid-64438-26906526.pdf?src-supplier=Verical; ComponentLink2Description: https://datasheet.ciiva.com/26906/getdatasheetpartid-64438-26906526.pdf?src-supplier=Verical; ComponentLink3URL: https://datasheet.ciiva.com/940/ao3400a-940740.pdf?src-supplier=Digi-Key; ComponentLink3Description: https://datasheet.ciiva.com/940/ao3400a-940740.pdf?src-supplier=Digi-Key; ComponentLink4URL: https://datasheet.ciiva.com/940/ao3400a-940741.pdf?src-supplier=Digi-Key; ComponentLink4Description: https://datasheet.ciiva.com/940/ao3400a-940741.pdf?src-supplier=Digi-Key; Supplier Part Number 1: AO3400A
R19 R22 R25 R28 = RES 0805 22K: CRCW Series 0805 0.125 W 22 KOhm ±5 % ±200 ppm/K SMT Thick Film Chip Resistor; Manufacturer: Vishay; Manufacturer Part Number: CRCW080522K0JNEAC; Supplier 1: Newark; ComponentLink1URL: http://datasheet.octopart.com/CRCW080522K0JNEAC-Vishay-datasheet-100063072.pdf?src-supplier=Future+Electronics; ComponentLink1Description: http://datasheet.octopart.com/CRCW080522K0JNEAC-Vishay-datasheet-100063072.pdf?src-supplier=Future+Electronics; Supplier Part Number 1: 59AC3958
R20 R21 R23 R24 R26 R27 = RES 0805 120: Res 120 Ohm 5% 1/8W 0805; Manufacturer: Vishay; Manufacturer Part Number: CRCW0805120RJNEAC; Supplier 1: TTI; Pricing 1: 60000=0,00353 (USD); Supplier Part Number 1: CRCW0805120RJNEAC